# EAGLE design voice board kombi (EAGLE 6.5.0)
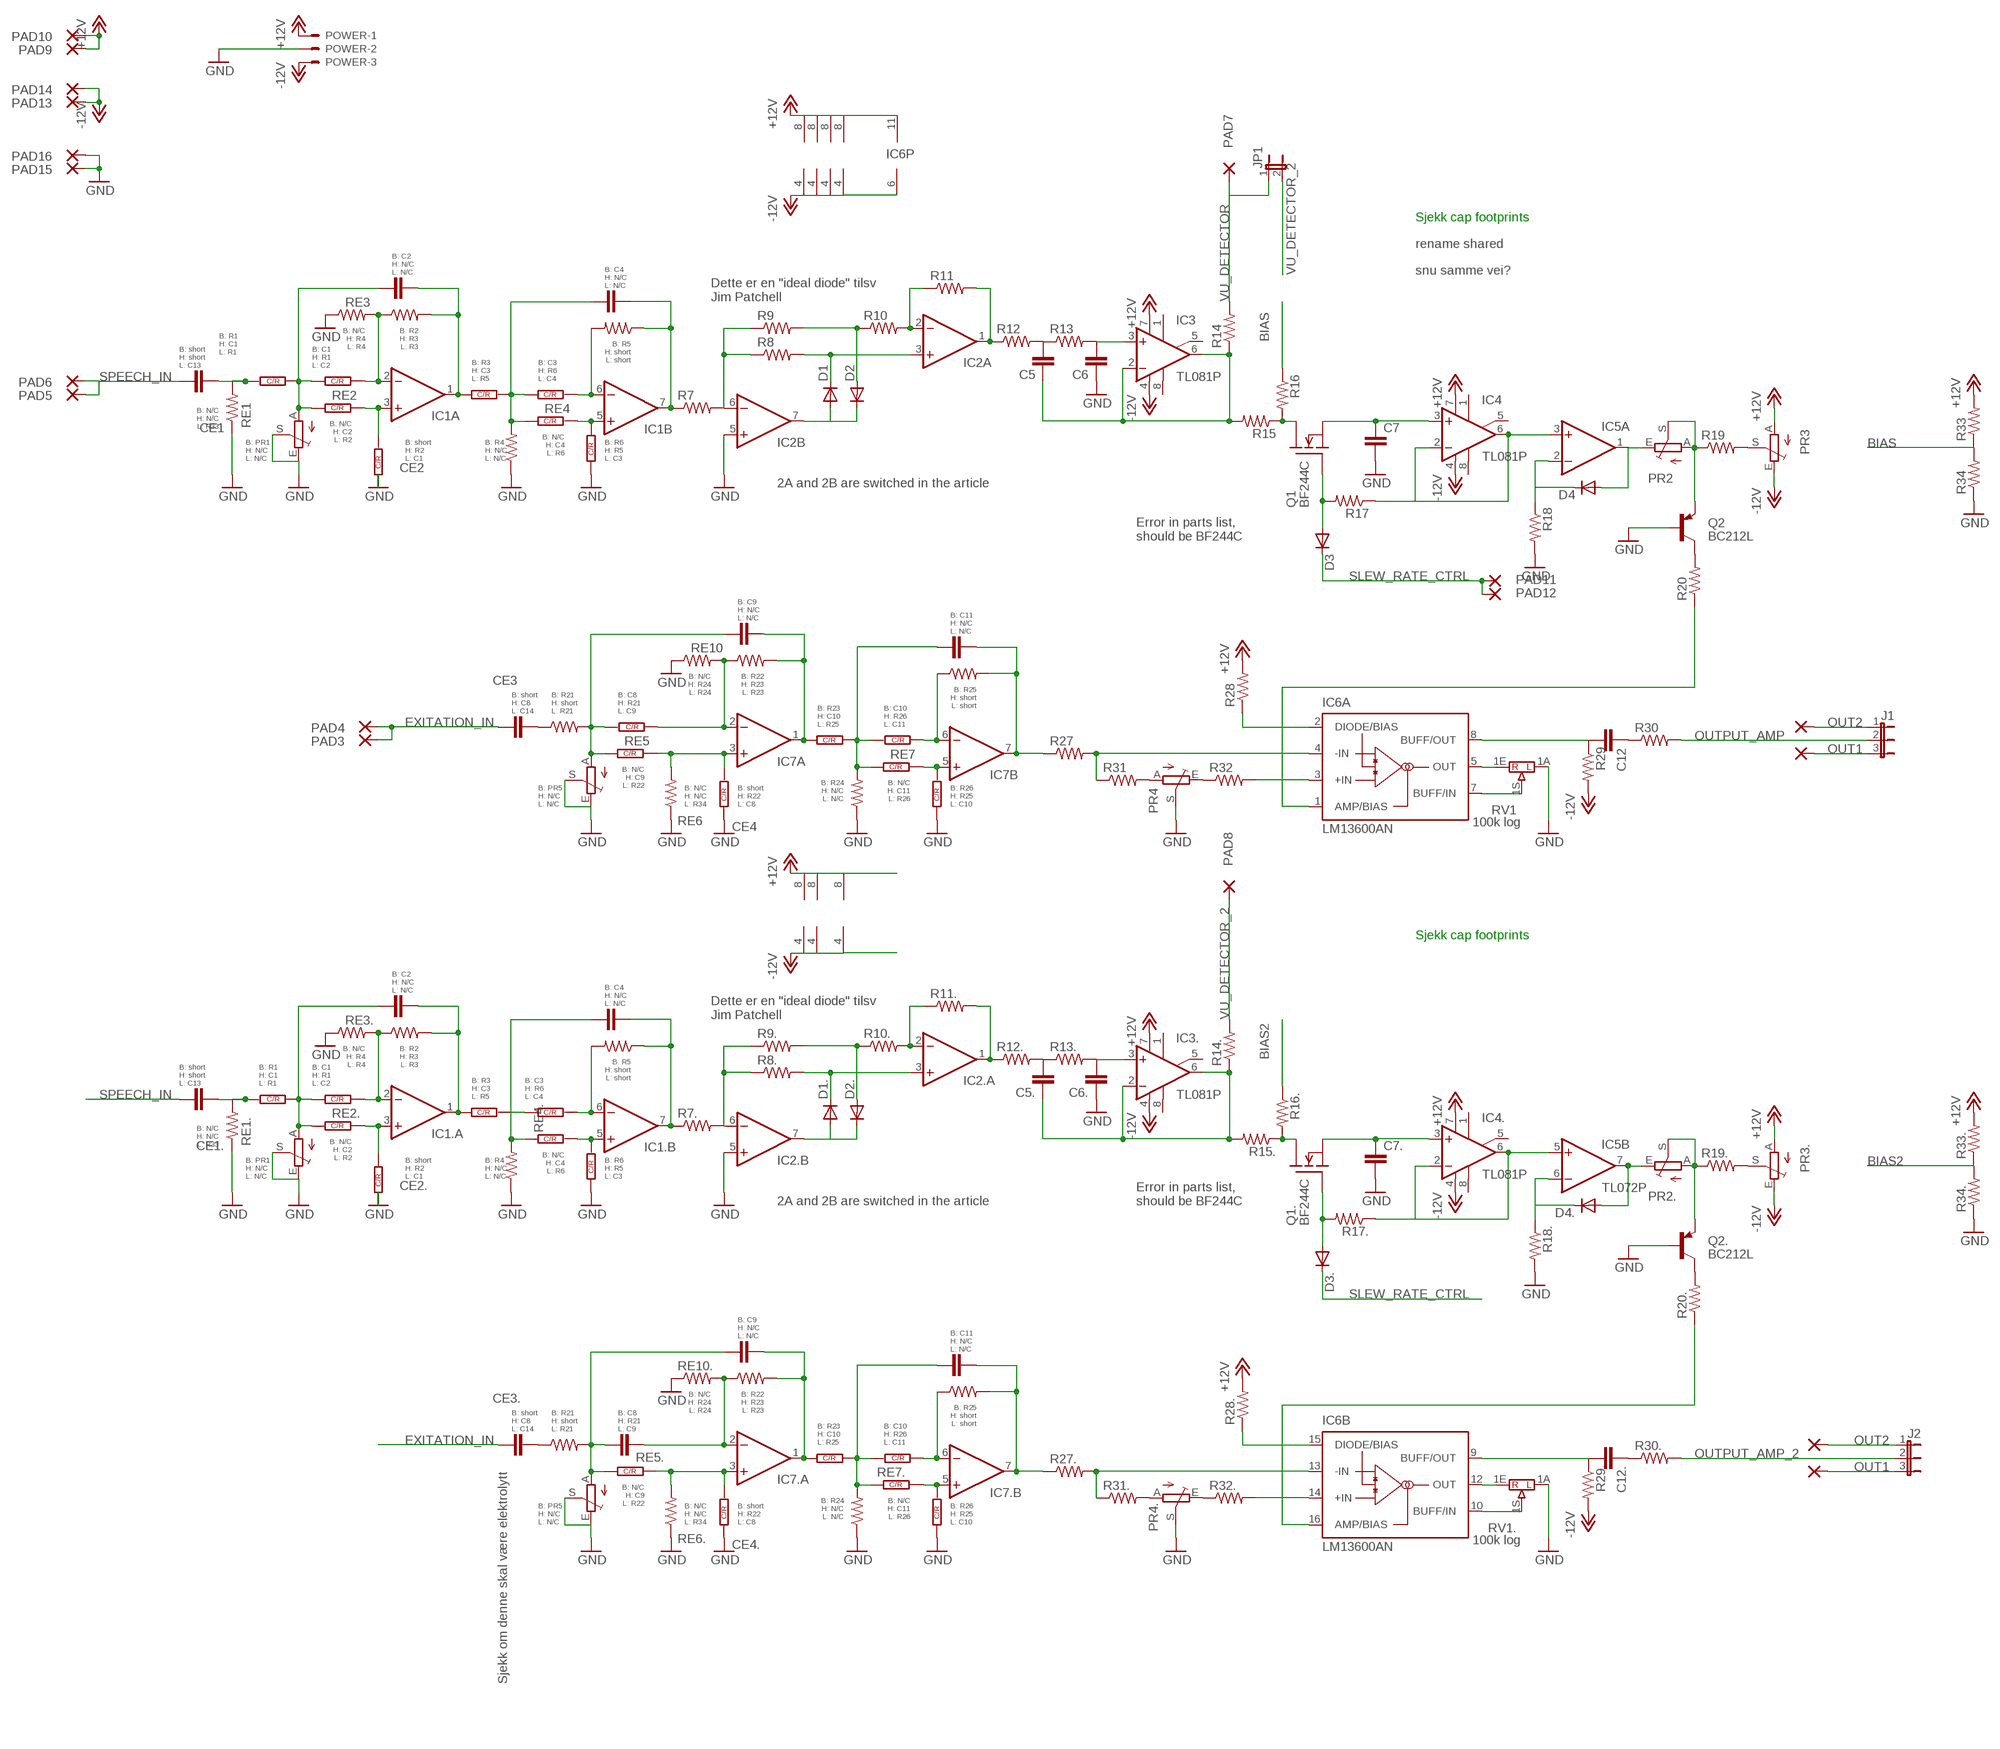
[diagram p0: schematic, sheet 1]

## Parts
C1  C-OR-R050_075-025X100  [P050_075-025X100J]
C1.  C-OR-R050_075-025X100  [P050_075-025X100J]
C2  C-EU050_075-025X100  [C050_075-025X100J]
C2.  C-EU050_075-025X100  [C050_075-025X100J]
C3  C-OR-R050_075-025X100  [P050_075-025X100J]
C3.  C-OR-R050_075-025X100  [P050_075-025X100J]
C4  C-EU050_075-025X100  [C050_075-025X100J]
C4.  C-EU050_075-025X100  [C050_075-025X100J]
C5  C-EU050_075-025X100  [C050_075-025X100J]
C5.  C-EU050_075-025X100  [C050_075-025X100J]
C6  C-EU050_075-025X100  [C050_075-025X100J]
C6.  C-EU050_075-025X100  [C050_075-025X100J]
C7  C-EU050_075-025X100  [C050_075-025X100J]
C7.  C-EU050_075-025X100  [C050_075-025X100J]
C8  C-OR-R050_075-025X100  [P050_075-025X100J]
C8.  C-EU050_075-025X100  [C050_075-025X100J]
C9  C-EU050_075-025X100  [C050_075-025X100J]
C9.  C-EU050_075-025X100  [C050_075-025X100J]
C10  C-OR-R050_075-025X100  [P050_075-025X100J]
C10.  C-OR-R050_075-025X100  [P050_075-025X100J]
C11  C-EU050_075-025X100  [C050_075-025X100J]
C11.  C-EU050_075-025X100  [C050_075-025X100J]
C12  C-EU050_075-025X100  [C050_075-025X100J]
C12.  C-EU050_075-025X100  [C050_075-025X100J]
CE1  C-EU050_075-025X100  [C050_075-025X100J]
CE1.  C-EU050_075-025X100  [C050_075-025X100J]
CE2  C-OR-R050_075-025X100  [P050_075-025X100J]
CE2.  C-OR-R050_075-025X100  [P050_075-025X100J]
CE3  C-EU050_075-025X100  [C050_075-025X100J]
CE3.  C-EU050_075-025X100  [C050_075-025X100J]
CE4  C-OR-R050_075-025X100  [P050_075-025X100J]
CE4.  C-OR-R050_075-025X100  [P050_075-025X100J]
D1  DIODE-D-5  [D-5]
D1.  DIODE-D-5  [D-5]
D2  DIODE-D-5  [D-5]
D2.  DIODE-D-5  [D-5]
D3  DIODE-D-5  [D-5]
D3.  DIODE-D-5  [D-5]
D4  DIODE-D-5  [D-5]
D4.  DIODE-D-5  [D-5]
IC1  TL072P  [DIL08]
IC1.  TL072P  [DIL08]
IC2  TL072P  [DIL08]
IC2.  TL072P  [DIL08]
IC3  TL081P  [DIL08]
IC3.  TL081P  [DIL08]
IC4  TL081P  [DIL08]
IC4.  TL081P  [DIL08]
IC5  TL072P  [DIL08]
IC6  LM13600AN  [DIL16]
IC7  TL072P  [DIL08]
IC7.  TL072P  [DIL08]
J1  JP2E  [JP2]
J2  JP2E  [JP2]
JP1  JP1E  [JP1]
PAD1  WIREPAD2,54/1,1  [2,54/1,1]
PAD2  WIREPAD2,54/1,1  [2,54/1,1]
PAD3  WIREPAD2,54/1,1  [2,54/1,1]
PAD4  WIREPAD2,54/1,1  [2,54/1,1]
PAD5  WIREPAD2,54/1,1  [2,54/1,1]
PAD6  WIREPAD2,54/1,1  [2,54/1,1]
PAD7  WIREPAD2,54/1,1  [2,54/1,1]
PAD8  WIREPAD2,54/1,1  [2,54/1,1]
PAD9  WIREPAD2,54/1,1  [2,54/1,1]
PAD10  WIREPAD2,54/1,1  [2,54/1,1]
PAD11  WIREPAD2,54/1,1  [2,54/1,1]
PAD12  WIREPAD2,54/1,1  [2,54/1,1]
PAD13  WIREPAD2,54/1,1  [2,54/1,1]
PAD14  WIREPAD2,54/1,1  [2,54/1,1]
PAD15  WIREPAD2,54/1,1  [2,54/1,1]
PAD16  WIREPAD2,54/1,1  [2,54/1,1]
PAD17  WIREPAD2,54/1,1  [2,54/1,1]
PAD18  WIREPAD2,54/1,1  [2,54/1,1]
POWER  KK-156-3  [KK-156-3]
PR1  TRIM_EU-CA9V  [CA9V]
PR1.  TRIM_EU-CA9V  [CA9V]
PR2  TRIM_EU-CA9V  [CA9V]
PR2.  TRIM_EU-CA9V  [CA9V]
PR3  TRIM_EU-CA9V  [CA9V]
PR3.  TRIM_EU-CA9V  [CA9V]
PR4  TRIM_EU-CA9V  [CA9V]
PR4.  TRIM_EU-CA9V  [CA9V]
PR5  TRIM_EU-CA9V  [CA9V]
PR5.  TRIM_EU-CA9V  [CA9V]
Q1  BF244C  TN0602N3  [TO-92]
Q1.  BF244C  TN0602N3  [TO-92]
Q2  BC212L  -PNP-TO92-ECB  [TO92-ECB]
Q2.  BC212L  -PNP-TO92-ECB  [TO92-ECB]
R1  C-OR-R050_075-025X100  [P050_075-025X100J]
R1.  C-OR-R050_075-025X100  [P050_075-025X100J]
R2  R-US_0207/7  [0207/7]
R2.  R-US_0207/7  [0207/7]
R3  C-OR-R050_075-025X100  [P050_075-025X100J]
R3.  C-OR-R050_075-025X100  [P050_075-025X100J]
R4  R-US_0207/7  [0207/7]
R4.  R-US_0207/7  [0207/7]
R5  R-US_0207/7  [0207/7]
R5.  R-US_0207/7  [0207/7]
R6  C-OR-R050_075-025X100  [P050_075-025X100J]
R6.  C-OR-R050_075-025X100  [P050_075-025X100J]
R7  R-US_0207/7  [0207/7]
R7.  R-US_0207/7  [0207/7]
R8  R-US_0207/7  [0207/7]
R8.  R-US_0207/7  [0207/7]
R9  R-US_0207/7  [0207/7]
R9.  R-US_0207/7  [0207/7]
R10  R-US_0207/7  [0207/7]
R10.  R-US_0207/7  [0207/7]
R11  R-US_0207/7  [0207/7]
R11.  R-US_0207/7  [0207/7]
R12  R-US_0207/7  [0207/7]
R12.  R-US_0207/7  [0207/7]
R13  R-US_0207/7  [0207/7]
R13.  R-US_0207/7  [0207/7]
R14  R-US_0207/7  [0207/7]
R14.  R-US_0207/7  [0207/7]
R15  R-US_0207/7  [0207/7]
R15.  R-US_0207/7  [0207/7]
R16  R-US_0207/7  [0207/7]
R16.  R-US_0207/7  [0207/7]
R17  R-US_0207/7  [0207/7]
R17.  R-US_0207/7  [0207/7]
R18  R-US_0207/7  [0207/7]
R18.  R-US_0207/7  [0207/7]
R19  R-US_0207/7  [0207/7]
R19.  R-US_0207/7  [0207/7]
R20  R-US_0207/7  [0207/7]
R20.  R-US_0207/7  [0207/7]
R21  R-US_0207/7  [0207/7]
R21.  R-US_0207/7  [0207/7]
R22  R-US_0207/7  [0207/7]
R22.  R-US_0207/7  [0207/7]
R23  C-OR-R050_075-025X100  [P050_075-025X100J]
R23.  C-OR-R050_075-025X100  [P050_075-025X100J]
R24  R-US_0207/7  [0207/7]
R24.  R-US_0207/7  [0207/7]
R25  R-US_0207/7  [0207/7]
R25.  R-US_0207/7  [0207/7]
R26  C-OR-R050_075-025X100  [P050_075-025X100J]
R26.  C-OR-R050_075-025X100  [P050_075-025X100J]
R27  R-US_0207/7  [0207/7]
R27.  R-US_0207/7  [0207/7]
R28  R-US_0207/7  [0207/7]
R28.  R-US_0207/7  [0207/7]
R29  R-US_0207/7  [0207/7]
R29.  R-US_0207/7  [0207/7]
R30  R-US_0207/7  [0207/7]
R30.  R-US_0207/7  [0207/7]
R31  R-US_0207/7  [0207/7]
R31.  R-US_0207/7  [0207/7]
R32  R-US_0207/7  [0207/7]
R32.  R-US_0207/7  [0207/7]
R33  R-US_0207/7  [0207/7]
R33.  R-US_0207/7  [0207/7]
R34  R-US_0207/7  [0207/7]
R34.  R-US_0207/7  [0207/7]
RE1  R-US_0207/7  [0207/7]
RE1.  R-US_0207/7  [0207/7]
RE2  C-OR-R050_075-025X100  [P050_075-025X100J]
RE2.  C-OR-R050_075-025X100  [P050_075-025X100J]
RE3  R-US_0207/7  [0207/7]
RE3.  R-US_0207/7  [0207/7]
RE4  C-OR-R050_075-025X100  [P050_075-025X100J]
RE4.  C-OR-R050_075-025X100  [P050_075-025X100J]
RE5  C-OR-R050_075-025X100  [P050_075-025X100J]
RE5.  C-OR-R050_075-025X100  [P050_075-025X100J]
RE6  R-US_0207/7  [0207/7]
RE6.  R-US_0207/7  [0207/7]
RE7  C-OR-R050_075-025X100  [P050_075-025X100J]
RE7.  C-OR-R050_075-025X100  [P050_075-025X100J]
RE10  R-US_0207/7  [0207/7]
RE10.  R-US_0207/7  [0207/7]
RV1  100k log  POT16_W_BRACKET""  [POT16_W_BRACKET]
RV1.  100k log  POT16_W_BRACKET""  [POT16_W_BRACKET]

## Nets
+12V: IC1.8(P:V+) IC1..8(P:V+) IC2.8(P:V+) IC2..8(P:V+) IC3.7(V+) IC3..7(V+) IC4.7(V+) IC4..7(V+) IC5.8(P:V+) IC6.11(P:V+) IC7.8(P:V+) IC7..8(P:V+) PAD9.1(P) PAD10.1(P) POWER.1 PR3..A PR3.A R28.2 R28..2 R33.2 R33..2
-12V: IC1.4(P:V-) IC1..4(P:V-) IC2.4(P:V-) IC2..4(P:V-) IC3.4(V-) IC3..4(V-) IC4.4(V-) IC4..4(V-) IC5.4(P:V-) IC6.6(P:V-) IC7.4(P:V-) IC7..4(P:V-) PAD13.1(P) PAD14.1(P) POWER.3 PR3..E PR3.E R29.2 R29..2
BIAS: R16.1 R33.1 R34.2
BIAS2: R16..1 R33..1 R34..2
EXITATION_IN: CE3.1 CE3..1 PAD3.1(P) PAD4.1(P)
GND: C6.1 C6..1 C7.2 C7.3 C7..2 C7..3 CE2.1 CE2..1 CE4.1 CE4..1 IC2.5(B:+IN) IC2..5(B:+IN) PAD15.1(P) PAD16.1(P) POWER.2 PR1..E PR1..S PR1.E PR1.S PR4..S PR4.S PR5..E PR5..S PR5.E PR5.S Q2..B Q2.B R4.1 R4..1 R6.1 R6..1 R18.2 R18..2 R24.1 R24..1 R26.1 R26..1 R34.1 R34..1 RE1.1 RE1..1 RE3.1 RE3..1 RE6.1 RE6..1 RE10.1 RE10..1 RV1.1A RV1..1A
N$1: C1.2 C1.3 IC1.2(A:-IN) R2.1 RE3.2
N$2: C1.1 C2.1 PR1.A R1.1 RE2.1
N$3: C2.2 C2.3 IC1.1(A:OUT) R2.2 R3.1
N$4: IC2.6(B:-IN) R7.2 R8.1 R9.1
N$5: C3.1 C4.1 R3.2 R3.3 R4.2 RE4.1
N$6: C3.2 C3.3 IC1.6(B:-IN) R5.2
N$7: IC1.5(B:+IN) R6.2 R6.3 RE4.2 RE4.3
N$8: C4.2 C4.3 IC1.7(B:OUT) R5.1 R7.1
N$9: D1.C IC2.3(A:+IN) R8.2
N$10: D1.A D2.C IC2.7(B:OUT)
N$11: D2.A R9.2 R10.1
N$12: IC2.2(A:-IN) R10.2 R11.1
N$13: IC2.1(A:OUT) R11.2 R12.1
N$14: C5.2 C5.3 R12.2 R13.1
N$15: C5.1 IC3.2(-IN) IC3.6(OUT) R14.1 R15.2
N$16: C6.2 C6.3 IC3.3(+IN) R13.2
N$17: Q1.3(D) R15.1 R16.2
N$18: C7.1 IC4.3(+IN) Q1.1(S)
N$19: D3.A Q1.2(G) R17.2
N$20: IC4.2(-IN) IC4.6(OUT) IC5.3(A:+IN) R17.1
N$21: D4.C IC5.2(A:-IN) R18.1
N$22: D4.A IC5.1(A:OUT) PR2.E
N$23: PR2.A PR2.S Q2.E R19.1
N$24: PR3.S R19.2
N$25: Q2.C R20.2
N$26: PR4.A R31.2
N$27: C8.2 C8.3 C9.2 C9.3 PR5.A R21.2 RE5.1
N$28: C10.2 C10.3 C11.2 C11.3 R23.2 R23.3 R24.2 RE7.1
N$29: C8.1 IC7.2(A:-IN) R22.1 RE10.2
N$30: C9.1 IC7.1(A:OUT) R22.2 R23.1
N$31: C10.1 IC7.6(B:-IN) R25.1
N$32: IC7.5(B:+IN) R26.2 R26.3 RE7.2 RE7.3
N$33: C12.2 C12.3 IC6.8(A:BUFF/OUT) R29.1
N$34: C12.1 R30.1
N$35: C11.1 IC7.7(B:OUT) R25.2 R27.1
N$36: PR4.E R32.1
N$37: IC6.3(A:+IN) R32.2
N$38: IC6.2(A:DIODE/BIAS) R28.1
N$39: IC6.4(A:-IN) R27.2 R31.1
N$40: IC6.1(A:AMP/BIAS) R20.1
N$41: IC6.5(A:OUT) RV1.1E
N$42: IC6.7(A:BUFF/IN) RV1.1S
N$43: CE1.1 R1.2 R1.3 RE1.2
N$44: CE2.2 CE2.3 IC1.3(A:+IN) RE2.2 RE2.3
N$45: CE3.2 CE3.3 R21.1
N$46: CE4.2 CE4.3 IC7.3(A:+IN) RE5.2 RE5.3 RE6.2
N$47: C1..2 C1..3 IC1..2(A:-IN) R2..1 RE3..2
N$48: C1..1 C2..1 PR1..A R1..1 RE2..1
N$49: C2..2 C2..3 IC1..1(A:OUT) R2..2 R3..1
N$50: C3..1 C4..1 R3..2 R3..3 R4..2 RE4..1
N$51: C3..2 C3..3 IC1..6(B:-IN) R5..2
N$52: IC1..5(B:+IN) R6..2 R6..3 RE4..2 RE4..3
N$53: C4..2 C4..3 IC1..7(B:OUT) R5..1 R7..1
N$54: IC2..6(B:-IN) R7..2 R8..1 R9..1
N$55: D1..C IC2..3(A:+IN) R8..2
N$56: D1..A D2..C IC2..7(B:OUT)
N$57: D2..A R9..2 R10..1
N$58: IC2..2(A:-IN) R10..2 R11..1
N$59: IC2..1(A:OUT) R11..2 R12..1
N$60: C5..2 C5..3 R12..2 R13..1
N$61: C5..1 IC3..2(-IN) IC3..6(OUT) R14..1 R15..2
N$62: C6..2 C6..3 IC3..3(+IN) R13..2
N$63: Q1..3(D) R15..1 R16..2
N$64: C7..1 IC4..3(+IN) Q1..1(S)
N$65: D3..A Q1..2(G) R17..2
N$66: IC4..2(-IN) IC4..6(OUT) IC5.5(B:+IN) R17..1
N$67: D4..C IC5.6(B:-IN) R18..1
N$68: D4..A IC5.7(B:OUT) PR2..E
N$69: PR2..A PR2..S Q2..E R19..1
N$70: PR3..S R19..2
N$71: Q2..C R20..2
N$72: PR4..A R31..2
N$73: C8..2 C8..3 C9..2 C9..3 PR5..A R21..2 RE5..1
N$74: C10..2 C10..3 C11..2 C11..3 R23..2 R23..3 R24..2 RE7..1
N$75: C8..1 IC7..2(A:-IN) R22..1 RE10..2
N$76: C9..1 IC7..1(A:OUT) R22..2 R23..1
N$77: C11..1 IC7..7(B:OUT) R25..2 R27..1
N$78: PR4..E R32..1
N$79: IC6.14(B:+IN) R32..2
N$80: IC6.15(B:DIODE/BIAS) R28..1
N$81: IC6.13(B:-IN) R27..2 R31..1
N$82: IC6.16(B:AMP/BIAS) R20..1
N$83: IC6.10(B:BUFF/IN) RV1..1S
N$84: C12..2 C12..3 IC6.9(B:BUFF/OUT) R29..1
N$85: C12..1 R30..1
N$86: C10..1 IC7..6(B:-IN) R25..1
N$87: IC7..5(B:+IN) R26..2 R26..3 RE7..2 RE7..3
N$88: CE1..1 R1..2 R1..3 RE1..2
N$89: CE2..2 CE2..3 IC1..3(A:+IN) RE2..2 RE2..3
N$90: CE3..2 CE3..3 R21..1
N$91: CE4..2 CE4..3 IC7..3(A:+IN) RE5..2 RE5..3 RE6..2
N$92: IC6.12(B:OUT) RV1..1E
OUT1: J1.3 J2.3 PAD1.1(P) PAD2.1(P)
OUT2: J1.1 J2.1 PAD17.1(P) PAD18.1(P)
OUTPUT_AMP: J1.2 R30.2
OUTPUT_AMP_2: J2.2 R30..2
SLEW_RATE_CTRL: D3..C D3.C PAD11.1(P) PAD12.1(P)
SPEECH_IN: CE1.2 CE1.3 CE1..2 CE1..3 PAD5.1(P) PAD6.1(P)
VU_DETECTOR: JP1.1 PAD7.1(P) R14.2
VU_DETECTOR_2: JP1.2 PAD8.1(P) R14..2
Unconnected: IC3.1(ON1) IC3.5(ON2) IC3.8(OPT) IC3..1(ON1) IC3..5(ON2) IC3..8(OPT) IC4.1(ON1) IC4.5(ON2) IC4.8(OPT) IC4..1(ON1) IC4..5(ON2) IC4..8(OPT) RV1..M1 RV1..M2 RV1..M3 RV1..M4 RV1.M1 RV1.M2 RV1.M3 RV1.M4

## Notes on the sheet
- Sjekk cap footprints
- rename shared
- B: C2
  H: N/C
  L: N/C
- snu samme vei?
- B: C4
  H: N/C
  L: N/C
- Dette er en "ideal diode" tilsv
  Jim Patchell
- B: N/C
  H: R4
  L: R4
- B: R2
  H: R3
  L: R3
- B: R5
  H: short
  L: short
- B: R1
  H: C1
  L: R1
- B: short
  H: short
  L: C13
- B: C1
  H: R1
  L: C2
- B: R3
  H: C3
  L: R5
- B: C3
  H: R6
  L: C4
- B: N/C
  H: N/C
  L: R33
- B: N/C
  H: C2
  L: R2
- B: N/C
  H: C4
  L: R6
- B: PR1
  H: N/C
  L: N/C
- B: short
  H: R2
  L: C1
- B: R4
  H: N/C
  L: N/C
- B: R6
  H: R5
  L: C3
- 2A and 2B are switched in the article
- Error in parts list, 
  should be BF244C
- B: C9
  H: N/C
  L: N/C
- B: C11
  H: N/C
  L: N/C
- B: N/C
  H: R24
  L: R24
- B: R22
  H: R23
  L: R23
- B: R25
  H: short
  L: short
- B: short
  H: C8
  L: C14
- B: R21
  H: short
  L: R21
- B: C8
  H: R21
  L: C9
- B: R23
  H: C10
  L: R25
- B: C10
  H: R26
  L: C11
- B: N/C
  H: C9
  L: R22
- B: R24
  H: N/C
  L: N/C
- B: N/C
  H: C11
  L: R26
- B: PR5
  H: N/C
  L: N/C
- B: N/C
  H: N/C
  L: R34
- B: short
  H: R22
  L: C8
- B: R26
  H: R25
  L: C10
- Sjekk cap footprints
- B: C2
  H: N/C
  L: N/C
- B: C4
  H: N/C
  L: N/C
- Dette er en "ideal diode" tilsv
  Jim Patchell
- B: N/C
  H: R4
  L: R4
- B: R2
  H: R3
  L: R3
- B: R5
  H: short
  L: short
- B: short
  H: short
  L: C13
- B: R1
  H: C1
  L: R1
- B: C1
  H: R1
  L: C2
- B: R3
  H: C3
  L: R5
- B: C3
  H: R6
  L: C4
- B: N/C
  H: N/C
  L: R33
- B: N/C
  H: C2
  L: R2
- B: N/C
  H: C4
  L: R6
- B: PR1
  H: N/C
  L: N/C
- B: short
  H: R2
  L: C1
- B: R4
  H: N/C
  L: N/C
- B: R6
  H: R5
  L: C3
- 2A and 2B are switched in the article
- Error in parts list, 
  should be BF244C
- B: C9
  H: N/C
  L: N/C
- B: C11
  H: N/C
  L: N/C
- B: N/C
  H: R24
  L: R24
- B: R22
  H: R23
  L: R23
- B: R25
  H: short
  L: short
- B: short
  H: C8
  L: C14
- B: R21
  H: short
  L: R21
- B: C8
  H: R21
  L: C9
- B: R23
  H: C10
  L: R25
- B: C10
  H: R26
  L: C11
- Sjekk om denne skal være elektrolytt
- B: N/C
  H: C9
  L: R22
- B: R24
  H: N/C
  L: N/C
- B: N/C
  H: C11
  L: R26
- B: PR5
  H: N/C
  L: N/C
- B: N/C
  H: N/C
  L: R34
- B: short
  H: R22
  L: C8
- B: R26
  H: R25
  L: C10

## Library data of the parts
C1 C1. C3 C3. C8 C10 C10. CE2 CE2. CE4 CE4. R1 R1. R3 R3. R6 R6. R23 R23. R26 R26. RE2 RE2. RE4 RE4. RE5 RE5. RE7 RE7. = joakim:C-OR-R: Combined part for resistors and capacitors
C2 C2. C4 C4. C5 C5. C6 C6. C7 C7. C8. C9 C9. C11 C11. C12 C12. CE1 CE1. CE3 CE3. = joakim:C-EU: CAPACITOR, European symbol
D1 D1. D2 D2. D3 D3. D4 D4. = diode:DIODE-: DIODE
IC1 IC1. IC2 IC2. IC5 IC7 IC7. = linear:TL072: OP AMP
IC3 IC3. IC4 IC4. = linear:TL081: OP AMP
IC6 = national-semiconductor:LM13600: Dual Operational Transconductance Amplifiers with Linearizing Diodes and Buffers Source: lm13600.PDF
J1 J2 = jumper:JP2E: JUMPER
JP1 = jumper:JP1E: JUMPER
PAD1-PAD18 = wirepad:WIREPAD: Wire PAD connect wire on PCB
POWER = con-molex:KK-156-3: KK 156 HEADER Source: http://www.molex.com/pdm_docs/sd/026604100_sd.pdf; OC_FARNELL: unknown; OC_NEWARK: unknown
PR1 PR1. PR2 PR2. PR3 PR3. PR4 PR4. PR5 PR5. = pot:TRIM_EU-: POTENTIOMETER
Q1 Q1. = transistor-fet:TN0602N3: N-Channel Enhancement MOSFET 20V; 4A; 0,75Ohm
Q2 Q2. = transistor-neu-to92:*-PNP-: PNP Transistror
R2 R2. R4 R4. R5 R5. R7 R7. R8 R8. R9 R9. R10 R10. R11 R11. R12 R12. R13 R13. R14 R14. R15 R15. R16 R16. R17 R17. R18 R18. R19 R19. R20 R20. R21 R21. R22 R22. R24 R24. R25 R25. R27 R27. R28 R28. R29 R29. R30 R30. R31 R31. R32 R32. R33 R33. R34 R34. RE1 RE1. RE3 RE3. RE6 RE6. RE10 RE10. = resistor:R-US_: RESISTOR, American symbol
RV1 RV1. = joakim:POT16_W_BRACKET: POTENTIOMETER potentiometer, 16 mm w 5mm pitch and OMEG bracket, 17,8 x 7,5 mm

## Board
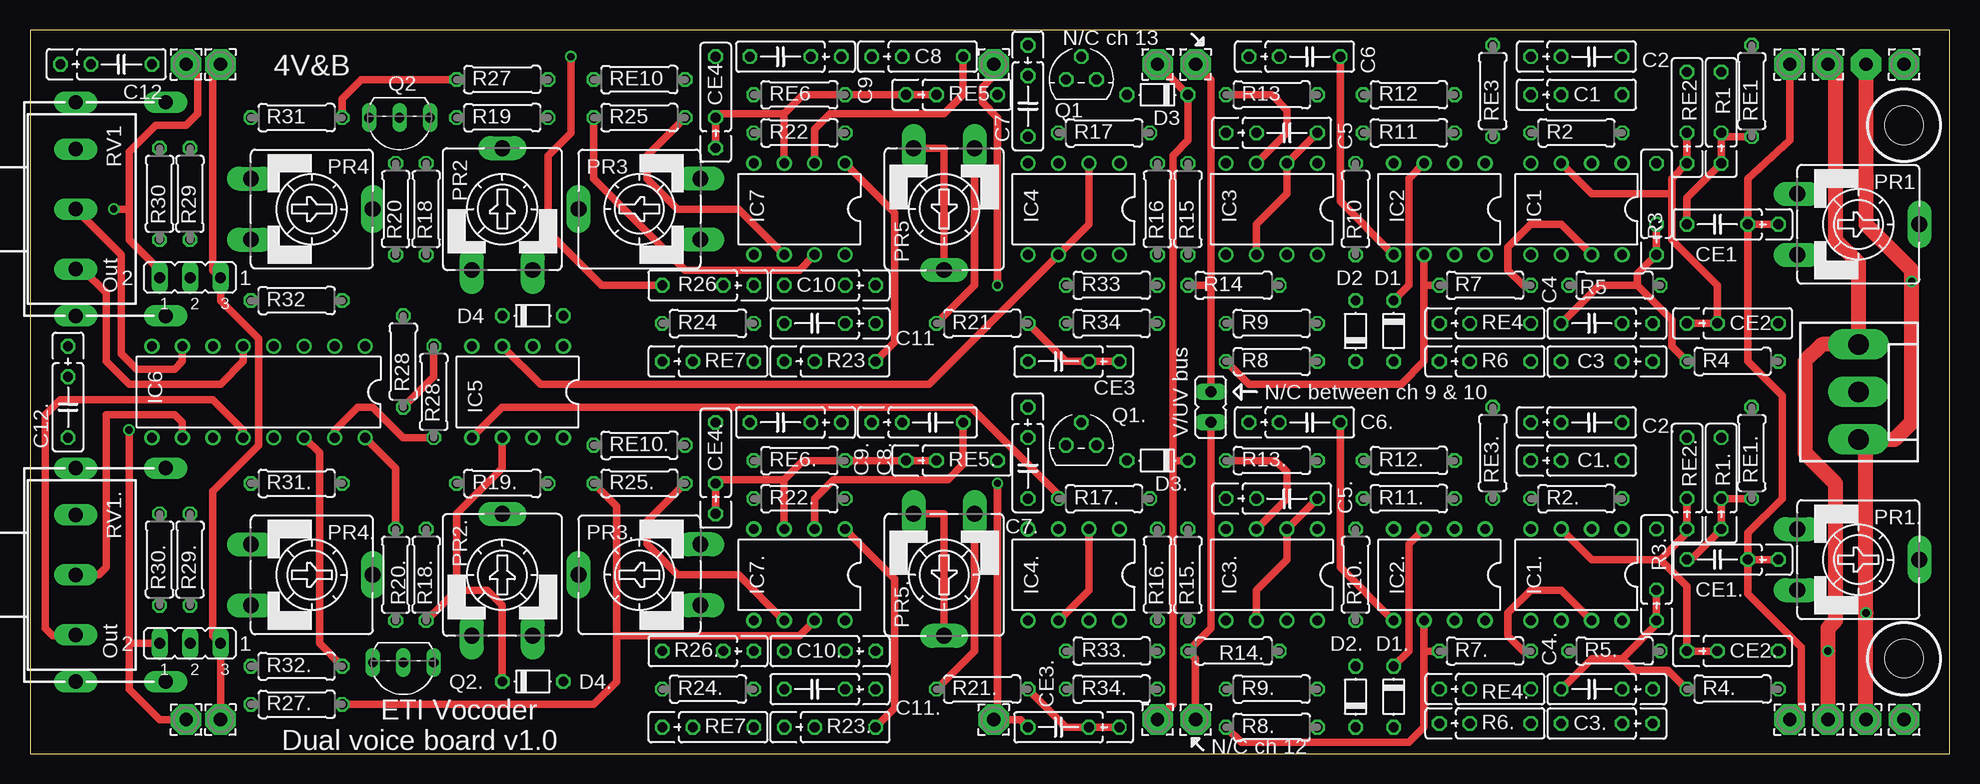
[diagram p1: board, top side]
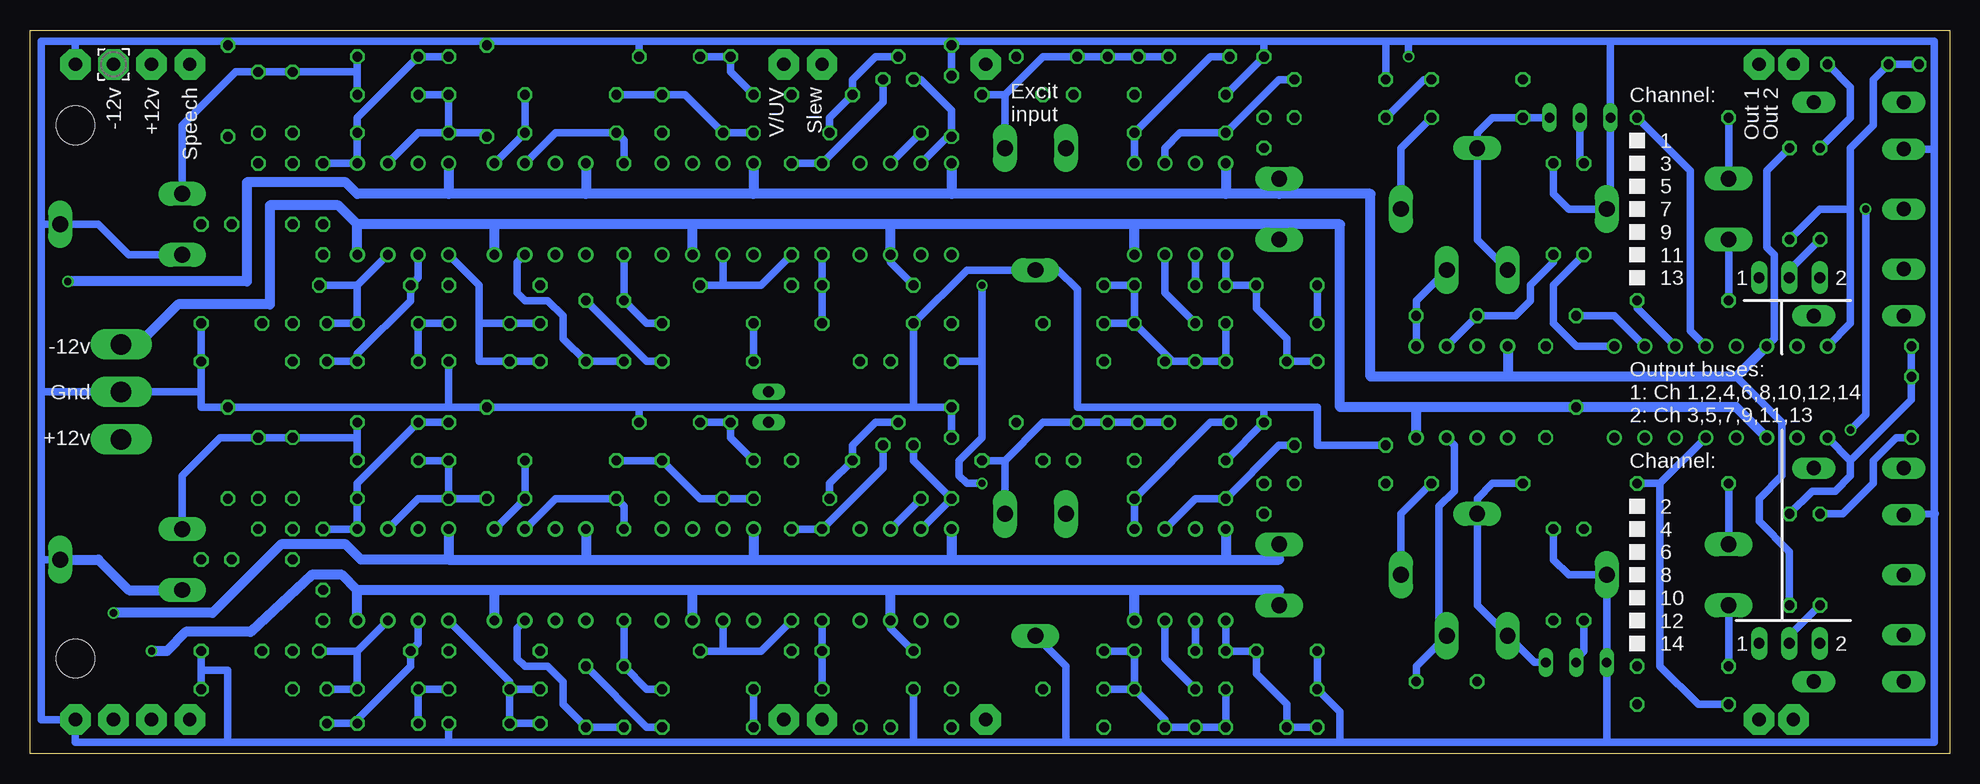
[diagram p2: board, bottom side, seen from below]

Size 160 x 60.33 mm. Coordinates in mm from the lower left corner, seen from the top.
Outline: 0,0 160,0 160,60.33 0,60.33 0,0
Copper layers (1*16): Top 0.0356mm / dielectric 1.5011mm / Bottom 0.0356mm
Design rules "oshpark-2layer": minimum track width 6mil, minimum drill 13mil, track to track 6mil, track to pad 6mil, pad to pad 6mil, via to via 6mil, smd to smd 6mil, copper to edge 15mil, drill to drill 6mil, minimum pad ring 7mil, minimum via ring 7mil, stop-mask expansion 2.5mil, vias tented up to drill 0mil, thermal gap 10mil
Holes 3.2 mm at 156.21,52.39 156.21,7.94

### Footprints (pad centres in the part's own frame; a part is rotated, then mirrored left to right if it is on the bottom)
P050_075-025X100J = drill 0.813 octagon: 1 -3.81,0; 2 1.27,0; 3 3.81,0
C050_075-025X100J = drill 0.813 octagon: 1 -2.54,0; 2 2.54,0; 3 5.08,0
D-5 = drill 0.813 octagon: A 2.54,0; C -2.54,0
DIL08 = drill 0.813 pad 1.27: 1 -3.81,-3.81; 2 -1.27,-3.81; 3 1.27,-3.81; 4 3.81,-3.81; 5 3.81,3.81; 6 1.27,3.81; 7 -1.27,3.81; 8 -3.81,3.81
DIL16 = drill 0.813 pad 1.27: 1 -8.89,-3.81; 2 -6.35,-3.81; 3 -3.81,-3.81; 4 -1.27,-3.81; 5 1.27,-3.81; 6 3.81,-3.81; 7 6.35,-3.81; 8 8.89,-3.81; 9 8.89,3.81; 10 6.35,3.81; 11 3.81,3.81; 12 1.27,3.81; 13 -1.27,3.81; 14 -3.81,3.81; 15 -6.35,3.81; 16 -8.89,3.81
JP2 = drill 0.914 long: 1 -2.54,0; 2 0,0; 3 2.54,0
JP1 = drill 0.914 long: 1 0,-1.27; 2 0,1.27
2,54/1,1 = drill 1.118 pad 2.54 octagon: 1 0,0
KK-156-3 = drill 1.7 pad 2.184 long: 1 -3.96,0; 2 0,0; 3 3.96,0
CA9V = drill 1.321 long: A -2.54,-5.08; E 2.54,-5.08; S 0,5.08
TO-92 = drill 0.813 octagon: 1 -1.27,0; 2 0,1.905; 3 1.27,0
TO92-ECB = drill 0.813 long: B 2.54,0; C 0,0; E -2.54,0
0207/7 = drill 0.813 octagon: 1 -3.81,0; 2 3.81,0
POT16_W_BRACKET = drill 1.2 long: 1A -5,0; 1E 5,0; 1S 0,0; M1 -8.9,0; M2 8.9,0; M3 8.9,7.5; M4 -8.9,7.5

### Placement (x,y rotation side)
C1  128.91,54.93 180 top
C1.  128.91,24.45 180 top
C2  130.18,58.1 180 top
C2.  130.18,27.62 180 top
C3  131.44,32.7 0 top
C3.  131.44,2.54 0 top
C4  130.18,35.88 0 top
C4.  130.18,5.4 0 top
C5  104.78,51.75 180 top
C5.  104.78,21.27 180 top
C6  106.68,58.1 180 top
C6.  106.68,27.62 180 top
C7  83.19,53.98 90 top
C7.  83.19,23.81 90 top
C8  73.98,58.1 180 top
C8.  75.25,27.62 180 top
C9  62.55,58.1 0 top
C9.  62.55,27.62 0 top
C10  66.67,39.05 0 top
C10.  66.67,8.57 0 top
C11  65.41,35.88 0 top
C11.  65.41,5.4 0 top
C12  7.62,57.47 180 top
C12.  3.17,28.89 90 top
CE1  140.65,44.13 0 top
CE1.  140.65,16.19 0 top
CE2  141.92,35.88 180 top
CE2.  141.92,8.57 180 top
CE3  85.72,32.7 0 top
CE3.  85.72,2.22 0 top
CE4  57.15,54.29 270 top
CE4.  57.15,23.81 270 top
D1  113.67,35.24 270 top
D1.  113.67,4.76 270 top
D2  110.49,35.24 90 top
D2.  110.49,4.76 90 top
D3  93.98,54.93 180 top
D3.  93.98,24.45 180 top
D4  41.91,36.51 0 top
D4.  41.91,6.03 0 top
IC1  128.91,45.4 180 top
IC1.  128.91,14.92 180 top
IC2  117.47,45.4 180 top
IC2.  117.47,14.92 180 top
IC3  103.5,45.4 180 top
IC3.  103.5,14.92 180 top
IC4  87,45.4 180 top
IC4.  87,14.92 180 top
IC5  40.64,30.16 180 top
IC6  19.05,30.16 180 top
IC7  64.14,45.4 180 top
IC7.  64.14,14.92 180 top
J1  13.34,39.69 0 top
J2  13.34,9.21 0 top
JP1  98.42,28.89 180 top
PAD1  15.88,57.47 0 top
PAD2  15.88,2.86 0 top
PAD3  80.33,57.47 0 top
PAD4  80.33,2.86 0 top
PAD5  146.69,57.47 0 top
PAD6  146.69,2.86 0 top
PAD7  97.16,57.47 0 top
PAD8  97.16,2.86 0 top
PAD9  149.86,2.86 0 top
PAD10  149.86,57.47 0 top
PAD11  93.98,2.86 0 top
PAD12  93.98,57.47 0 top
PAD13  153.03,57.47 0 bottom
PAD14  153.03,2.86 0 top
PAD15  156.21,57.47 0 top
PAD16  156.21,2.86 0 top
PAD17  13.02,57.47 0 top
PAD18  13.02,2.86 0 top
POWER  152.4,30.16 270 top
PR1  152.4,44.13 270 top
PR1.  152.4,16.19 270 top
PR2  39.37,45.4 0 top
PR2.  39.37,14.92 0 top
PR3  50.8,45.4 90 top
PR3.  50.8,14.92 90 top
PR4  23.5,45.4 270 top
PR4.  23.5,14.92 270 top
PR5  76.2,45.4 180 top
PR5.  76.2,14.92 180 top
Q1  87.63,56.2 0 top
Q1.  87.63,25.72 0 top
Q2  30.8,53.02 180 top
Q2.  31.11,7.62 180 top
R1  140.97,53.02 270 top
R1.  140.97,22.54 270 top
R2  128.91,51.75 0 top
R2.  128.91,21.27 0 top
R3  135.57,45.4 270 top
R3.  135.57,14.92 270 top
R4  141.92,32.7 180 top
R4.  141.92,5.4 180 top
R5  132.08,39.05 180 top
R5.  132.08,8.57 180 top
R6  121.28,32.7 180 top
R6.  121.28,2.54 180 top
R7  121.28,39.05 180 top
R7.  121.28,8.57 180 top
R8  103.5,32.7 0 top
R8.  103.5,2.22 0 top
R9  103.5,35.88 0 top
R9.  103.5,5.4 0 top
R10  110.49,45.4 90 top
R10.  110.49,14.92 90 top
R11  114.94,51.75 0 top
R11.  114.94,21.27 0 top
R12  114.94,54.93 180 top
R12.  114.94,24.45 180 top
R13  103.5,54.93 180 top
R13.  103.5,24.45 180 top
R14  100.33,39.05 180 top
R14.  100.33,8.57 180 top
R15  96.52,45.4 270 top
R15.  96.52,14.92 270 top
R16  93.98,45.4 90 top
R16.  93.98,14.92 90 top
R17  89.53,51.75 0 top
R17.  89.53,21.27 0 top
R18  33.02,45.4 90 top
R18.  33.02,14.92 90 top
R19  39.37,53.02 0 top
R19.  39.37,22.54 0 top
R20  30.48,45.4 90 top
R20.  30.48,14.92 270 top
R21  79.38,35.88 180 top
R21.  79.38,5.4 180 top
R22  64.14,51.75 0 top
R22.  64.14,21.27 0 top
R23  66.67,32.7 180 top
R23.  66.67,2.22 180 top
R24  56.52,35.88 0 top
R24.  56.52,5.4 0 top
R25  50.8,53.02 180 top
R25.  50.8,22.54 180 top
R26  56.52,39.05 0 top
R26.  56.52,8.57 0 top
R27  39.37,56.2 180 top
R27.  22.23,4.13 180 top
R28  31.11,32.7 270 top
R28.  33.66,30.16 90 top
R29  13.34,46.67 90 top
R29.  13.34,16.19 270 top
R30  10.79,46.67 270 top
R30.  10.79,16.19 270 top
R31  22.23,53.02 180 top
R31.  22.23,22.54 180 top
R32  22.23,37.78 0 top
R32.  22.23,7.3 0 top
R33  90.17,39.05 180 top
R33.  90.17,8.57 180 top
R34  90.17,35.88 0 top
R34.  90.17,5.4 0 top
RE1  143.51,55.24 270 top
RE1.  143.51,25.08 270 top
RE2  138.11,53.02 270 top
RE2.  138.11,22.54 270 top
RE3  121.92,55.24 270 top
RE3.  121.92,25.08 270 top
RE4  121.28,35.88 180 top
RE4.  121.28,5.4 180 top
RE5  76.83,54.93 180 top
RE5.  76.83,24.45 180 top
RE6  64.14,54.93 0 top
RE6.  64.14,24.45 0 top
RE7  56.52,32.7 180 top
RE7.  56.52,2.22 180 top
RE10  50.8,56.2 0 top
RE10.  50.8,25.72 0 top
RV1  3.81,45.4 270 top
RV1.  3.81,14.92 270 top

### Tracks (layer width: path | path; a pad name or v marks a point on that pad's centre or on a via)
+12V  (via drill 0.6)
  Top 0.61: R28.2 33.66,31.43 R28..2
  Top 0.813: v149.86,8.57 149.86,10.48
  Top 1.27: PAD10.1 149.86,57.15 150.5,56.52 150.5,42.86 152.4,40.96 POWER.1 149.38,34.12 147.96,32.7 147.96,25.08 150.5,22.54 150.5,11.11 149.86,10.48 PAD9.1
  Bottom 0.61: R33.2 88.27,40.96 IC4.7 | R33..2 88.27,10.48 IC4..7
  Bottom 0.813: IC1.8 132.72,44.13 | IC6.11 17.78,28.89 R28.2 44.45,28.89 | 44.45,28.89 50.8,28.89 50.8,44.13 55.88,44.13 | 55.88,44.13 67.94,44.13 | 67.94,44.13 88.27,44.13 | 88.27,44.13 104.78,44.13 | 104.78,44.13 121.28,44.13 | 121.28,44.13 132.72,44.13 | IC2.8 121.28,44.13 | IC3.7 104.78,44.13 | IC4.7 88.27,44.13 | IC7.8 67.94,44.13 | PR3.A 55.88,44.13 | IC5.8 44.45,28.89 | 132.72,44.13 134.3,45.72 140.02,45.72 140.02,37.47 147.64,37.47 150.98,34.12 POWER.1 | PR3..A 55.88,13.65 67.94,13.65 | 67.94,13.65 88.27,13.65 | 88.27,13.65 104.78,13.65 | 104.78,13.65 121.28,13.65 | 121.28,13.65 132.72,13.65 | 132.72,13.65 133.99,14.92 136.53,14.92 141.6,10.16 147,10.16 148.59,8.57 v149.86,8.57 | IC7..8 67.94,13.65 | IC4..7 88.27,13.65 | IC3..7 104.78,13.65 | IC2..8 121.28,13.65 | IC1..8 132.72,13.65
-12V  (via drill 0.6)
  Top 1.27: PAD13.1 153.03,44.13 156.84,40.32 v156.84,39.37 156.84,27.62 155.43,26.2 POWER.3 152.55,26.35 153.03,26.35 v153.03,11.75 PAD14.1
  Bottom 0.61: IC6.6 14.61,34.61 14.61,41.59 15.24,42.23 15.24,48.58 R29.2 | 17.78,31.43 13.97,27.62 13.97,23.18 15.88,21.27 15.88,19.37 13.34,16.83 R29..2
  Bottom 0.813: IC6.6 17.78,31.43 36.83,31.43 | 36.83,31.43 48.26,31.43 48.26,46.67 55.88,46.67 | 55.88,46.67 60.33,46.67 | 60.33,46.67 83.19,46.67 | 83.19,46.67 99.69,46.67 | 99.69,46.67 113.67,46.67 | 113.67,46.67 125.09,46.67 | 125.09,46.67 132.72,46.67 133.67,47.62 141.92,47.62 141.92,39.37 v156.84,39.37 | IC1.4 125.09,46.67 | IC2.4 113.67,46.67 | IC3.4 99.69,46.67 | IC4.4 83.19,46.67 | IC7.4 60.33,46.67 | PR3.E 55.88,46.67 | IC5.4 36.83,31.43 | 125.09,16.19 132.4,16.19 133.67,17.46 139.06,17.46 144.78,11.75 v153.03,11.75 | IC1..4 125.09,16.19 | 125.09,16.19 113.67,16.19 | 113.67,16.19 99.69,16.19 | 99.69,16.19 83.19,16.19 | 83.19,16.19 60.33,16.19 | 60.33,16.19 55.88,16.19 PR3..E | IC7..4 60.33,16.19 | IC4..4 83.19,16.19 | IC3..4 99.69,16.19 | IC2..4 113.67,16.19
BIAS
  Bottom 0.61: R16.1 R33.1 R34.2
BIAS2
  Bottom 0.61: R34..2 R33..1 R16..1
EXITATION_IN  (via drill 0.6)
  Top 0.61: v80.64,39.05 80.64,53.02 79.38,54.29 79.38,55.56 80.33,56.52 PAD3.1 | v80.64,22.54 80.64,2.86 PAD4.1 82.55,2.86 CE3..1
  Bottom 0.61: v80.64,39.05 80.64,32.7 | v80.64,22.54 81.92,22.54 82.55,23.18 82.55,24.45 80.64,26.35 80.64,32.7 | 80.64,32.7 CE3.1
GND  (via drill 0.6)
  Top 0.61: R26.1 47.62,39.05 43.18,43.5 43.18,49.85 45.09,51.75 v45.09,58.1 | PR5.E 76.2,50.48 PR5.S | 147.32,42.23 PR1.E | IC2.5 109.22,46.04 C6.1 | IC2..5 109.22,15.56 C6..1 | PR5..S 76.2,20 PR5..E
  Bottom 0.61: RV1.1A 1.35,50.4 1.27,50.48 | 1.27,50.48 1.27,59.37 28.26,59.37 | R18.2 33.02,46.67 31.75,45.4 PR4.S 28.26,45.72 Q2.B 28.26,59.37 | 28.26,59.37 45.09,59.37 | 45.09,59.37 46.99,59.37 | 46.99,59.37 57.15,59.37 | R26.1 R24.1 | v45.09,58.1 45.09,59.37 | RE10.1 46.99,59.37 | RE6.1 CE4.1 57.15,59.37 | 1.27,50.48 1.27,20 | 1.27,20 1.27,0.95 28.57,0.95 | 86.36,28.89 109.22,28.89 | 109.22,28.89 RE3..1 | RE3..1 125.09,28.89 | 125.09,28.89 125.41,28.89 RE1..1 145.73,28.89 145.73,30.16 | 145.73,30.16 POWER.2 159.07,30.16 | 159.07,30.16 159.07,44.13 | 159.07,44.13 159.07,59.37 156.21,59.37 | 156.21,59.37 143.51,59.37 | RE1.1 143.51,59.37 | 143.51,59.37 121.92,59.37 | 109.22,59.37 83.19,59.37 | 83.19,59.37 57.15,59.37 | C6.1 109.22,59.37 | R6.1 125.09,28.89 | 109.22,59.37 121.92,59.37 | 121.92,59.37 RE3.1 | 145.73,30.16 R4.1 CE2.1 | 159.07,44.13 PR1.S 154.31,44.13 151.76,41.59 PR1.E | PAD15.1 156.21,59.37 | 159.07,16.19 159.07,2.86 PAD16.1 156.21,0.95 143.51,0.95 | 159.07,16.19 159.07,30.16 | C6..1 109.22,28.89 | 57.15,28.89 72.71,28.89 72.71,38.73 74.3,40.32 PR5.S 81.92,40.32 R34.1 86.36,28.89 | RE6..1 CE4..1 57.15,28.89 | RE10..1 52.7,25.72 52.7,28.89 57.15,28.89 | 143.51,0.95 125.09,0.95 | 125.09,0.95 86.36,0.95 | 86.36,0.95 73.66,0.95 | 73.66,0.95 50.8,0.95 | 50.8,0.95 28.57,0.95 | 1.27,20 1.19,20 RV1..1A | 154.31,16.19 159.07,16.19 | R4..1 CE2..1 145.73,6.99 143.51,6.99 143.51,0.95 | R6..1 125.09,0.95 | PR5..S 73.66,7.3 73.66,0.95 | R34..1 86.36,0.95 | 86.36,28.89 C7..3 C7..2 | R18..2 33.02,16.19 31.75,14.92 PR4..S Q2..B 28.57,0.95 | 50.8,0.95 50.8,3.49 R24..1 R26..1 | 83.19,59.37 C7.3 C7.2 | RE3..1 125.09,28.89
  Bottom 0.813: PR1..S 154.31,16.19 151.76,13.65 PR1..E
N$1
  Bottom 0.61: C1.2 C1.3 R2.1 | IC1.2 127.64,51.75 R2.1 | R2.1 121.92,51.75 RE3.2
N$2
  Bottom 0.61: 132.72,56.83 C1.1 | C2.1 132.72,56.83 | 132.72,56.83 RE2.1 R1.1 142.88,56.83 147.32,52.39 PR1.A
N$3
  Bottom 0.61: R3.1 IC1.1 R2.2 132.72,53.02 C2.2 C2.3
N$4
  Top 0.61: R8.1 101.6,30.8 114.3,30.8 116.2,32.7 116.2,39.05 | 116.2,39.05 IC2.6 | R7.2 116.2,39.05
  Bottom 0.61: R8.1 R9.1
N$5
  Top 0.61: 133.99,39.05 133.99,40.01 R3.3 R3.2 | 133.99,39.05 130.81,39.05 C4.1 | R4.2 136.84,33.97 136.84,36.2 133.99,39.05
  Bottom 0.61: RE4.1 C4.1 C3.1
N$6
  Bottom 0.61: IC1.6 127.64,39.69 R5.2 128.27,37.78 132.72,33.34 C3.2 C3.3
N$7
  Bottom 0.61: 122.56,35.88 122.56,32.7 R6.2 R6.3 | 122.56,35.88 RE4.2 RE4.3 | 122.56,35.88 122.56,39.05 IC1.5
N$8
  Top 0.61: IC1.7 127.64,44.13 125.09,44.13 123.19,42.23 123.19,40.32 124.46,39.05 R7.1
  Bottom 0.61: 132.72,39.05 C4.2 C4.3 | 132.72,39.05 R5.1 | IC1.7 132.72,39.05
N$9
  Top 0.61: D1.C 114.94,39.05 114.94,47.94 IC2.3
  Bottom 0.61: R8.2 108.58,32.7 D1.C
N$10
  Bottom 0.61: IC2.7 119.38,40.96 119.38,38.42 118.75,37.78 116.84,37.78 115.57,36.51 115.57,34.61 D1.A D2.C
N$11
  Bottom 0.61: R10.1 D2.A 108.58,35.88 R9.2
N$12
  Bottom 0.61: R10.2 110.49,51.12 R11.1 116.2,51.75 IC2.2
N$13
  Bottom 0.61: IC2.1 R11.2 R12.1
N$14
  Bottom 0.61: R12.2 R13.1 105.41,54.93 C5.2 C5.3
N$15
  Top 0.61: IC3.6 102.23,44.13 104.78,46.67 IC3.2 C5.1
  Bottom 0.61: R15.2 99.06,39.05 102.23,39.05 | 102.23,39.05 R14.1 | IC3.6 102.23,39.05
N$16
  Top 0.61: IC3.3 104.78,51.75 104.78,53.66 103.5,54.93 R13.2
  Bottom 0.61: C6.2 C6.3 101.6,56.83 R13.2
N$17
  Bottom 0.61: Q1.3 88.9,54.29 R16.2 R15.1
N$18
  Bottom 0.61: IC4.3 83.5,51.44 C7.1 83.19,53.66 85.72,56.2 Q1.1
N$19
  Bottom 0.61: Q1.2 89.53,58.1 91.44,56.2 D3.A 93.34,53.02 R17.2
N$20
  Top 0.61: IC5.3 42.55,30.8 74.93,30.8 IC4.6 88.27,44.13 IC4.2
  Bottom 0.61: IC4.2 R17.1
N$21
  Bottom 0.61: R18.1 33.02,40.96 34.92,39.05 34.92,37.78 36.2,36.51 D4.C IC5.2
N$22
  Bottom 0.61: IC5.1 D4.A 44.45,37.78 PR2.E
N$23
  Bottom 0.61: PR2.A 39.37,42.86 PR2.S 39.37,51.75 38.1,53.02 R19.1 Q2.E
N$24
  Bottom 0.61: PR3.S 45.72,50.48 R19.2
N$25
  Bottom 0.61: R20.2 30.8,49.53 Q2.C
N$26
  Bottom 0.61: R31.2 PR4.A
N$27
  Top 0.61: R21.2 78.74,39.05 PR5.A
  Bottom 0.61: 78.74,54.93 75.56,58.1 C8.2 C8.3 C9.3 C9.2 | 78.74,54.93 RE5.1 | PR5.A 78.74,54.93
N$28
  Bottom 0.61: R23.3 R23.2 64.77,32.7 | R23.3 RE7.1 R24.2 | C11.2 65.25,33.18 64.77,32.7 | C11.2 C10.2 C10.3 | C11.2 C11.3 | R23.3 64.77,32.7
N$29
  Top 0.61: C8.1 77.79,54.93 76.2,53.34 66.67,53.34 65.41,52.07 IC7.2
  Bottom 0.61: IC7.2 65.41,50.48 64.14,51.75 R22.1 55.88,56.2 RE10.2
N$30
  Top 0.61: R23.1 72.07,34.29 72.07,45.09 IC7.1
  Bottom 0.61: IC7.1 R22.2 61.59,58.1 C9.1
N$31
  Top 0.61: R25.1 51.44,49.85 51.44,47.94 53.98,45.4 59.05,45.4 IC7.6
  Bottom 0.61: C10.1 IC7.6
N$32
  Bottom 0.61: IC7.5 R26.3 R26.2 57.78,37.15 55.24,34.61 RE7.2 RE7.3
N$33
  Bottom 0.61: R29.1 10.79,45.4 8.26,45.4 | IC6.8 8.26,35.88 8.26,45.4 | 8.26,45.4 8.26,50.48 6.35,52.39 6.35,56.2 C12.2 C12.3
N$34
  Bottom 0.61: C12.1 8.26,55.56 8.26,53.02 R30.1
N$35
  Top 0.61: R25.2 46.99,47.94 54.61,40.32 64.14,40.32 IC7.7
  Bottom 0.61: R27.1 43.81,56.2 R25.2 | C11.1 65.41,38.42 IC7.7
N$36
  Bottom 0.61: R32.1 PR4.E
N$37
  Bottom 0.61: IC6.3 26.04,37.15 R32.2
N$38
  Bottom 0.61: IC6.2 27.94,36.51 R28.1
N$39
  Top 0.61: R27.2 27.62,56.2 26.04,54.61 R31.1
  Bottom 0.61: R31.1 21.59,48.58 21.59,35.24 IC6.4
N$40
  Bottom 0.61: R20.1 33.02,39.05 33.02,35.88 31.11,33.97 IC6.1
N$41
  Top 0.61: RV1.1E 4.37,40.4 6.35,38.42 6.35,32.7 8.26,30.8 15.88,30.8 17.78,32.7 IC6.5
N$42
  Top 0.61: RV1.1S 7.62,41.59 7.62,33.34 8.89,32.07 12.06,32.07 12.7,32.7 IC6.7
N$43
  Top 0.61: 143.19,51.44 RE1.2 140.97,51.44 | CE1.1 138.11,46.35 R1.3 140.97,51.44 | R1.2 140.97,51.44
N$44
  Top 0.61: RE2.2 RE2.3 136.84,47.94 136.84,46.67 | 136.84,46.67 130.18,46.67 IC1.3 | 136.84,46.67 136.84,42.86 140.65,39.05 CE2.2 CE2.3
N$45
  Top 0.61: R21.1 86.36,32.7 CE3.2 CE3.3
N$46
  Top 0.61: 62.87,53.34 57.47,53.34 CE4.2 CE4.3 | 62.87,53.34 64.45,54.93 RE6.2 RE5.3 RE5.2 | IC7.3 62.87,53.34
N$47
  Bottom 0.61: RE3..2 R2..1 | R2..1 C1..3 C1..2 | R2..1 127.64,21.27 IC1..2
N$48
  Bottom 0.61: C1..1 132.72,26.35 | 132.72,26.35 C2..1 | 132.72,26.35 RE2..1 R1..1 144.15,26.35 147.32,23.18 PR1..A
N$49
  Bottom 0.61: R3..1 IC1..1 R2..2 132.72,22.54 C2..2 C2..3
N$50
  Top 0.61: 132.72,7.94 135.57,10.79 R3..3 R3..2 | 132.72,7.94 130.18,7.94 C4..1 | R4..2 136.53,6.99 133.67,6.99 132.72,7.94
  Bottom 0.61: C3..1 C4..1 RE4..1
N$51
  Bottom 0.61: IC1..6 127.64,9.21 R5..2 128.27,7.3 132.72,2.86 C3..2 C3..3
N$52
  Bottom 0.61: RE4..2 R6..2 R6..3 | RE4..2 120.02,6.03 IC1..5 | RE4..2 RE4..3
N$53
  Top 0.61: R7..1 124.46,8.57 123.19,9.84 123.19,11.75 125.09,13.65 127.64,13.65 IC1..7
  Bottom 0.61: 132.72,8.57 C4..2 C4..3 | 132.72,8.57 IC1..7 | R5..1 132.72,8.57
N$54
  Top 0.61: IC2..6 116.2,8.57 | 116.2,8.57 116.2,2.22 114.94,0.95 100.97,0.95 R8..1 | R7..2 116.2,8.57
  Bottom 0.61: R9..1 R8..1
N$55
  Top 0.61: D1..C 114.94,8.57 114.94,17.46 IC2..3
  Bottom 0.61: R8..2 108.58,2.22 D1..C
N$56
  Bottom 0.61: D2..C D1..A 115.57,4.13 115.57,6.03 116.84,7.3 118.75,7.3 119.38,7.94 119.38,10.48 IC2..7
N$57
  Bottom 0.61: R9..2 108.58,5.4 D2..A R10..1
N$58
  Bottom 0.61: R10..2 110.49,20.64 R11..1 116.2,21.27 IC2..2
N$59
  Bottom 0.61: IC2..1 R11..2 R12..1
N$60
  Bottom 0.61: R12..2 R13..1 104.14,21.27 C5..2 C5..3
N$61
  Top 0.61: C5..1 IC3..2 104.78,16.19 102.23,13.65 IC3..6
  Bottom 0.61: IC3..6 102.23,8.57 | 102.23,8.57 99.06,8.57 R15..2 | R14..1 102.23,8.57
N$62
  Top 0.61: IC3..3 104.78,21.27 104.78,23.5 103.82,24.45 R13..2
  Bottom 0.61: R13..2 101.6,26.35 C6..3 C6..2
N$63
  Bottom 0.61: Q1..3 88.9,23.81 R16..2 R15..1
N$64
  Bottom 0.61: Q1..1 86.36,24.45 C7..1 IC4..3
N$65
  Bottom 0.61: R17..2 93.34,22.54 D3..A 91.44,25.72 89.53,27.62 Q1..2
N$66
  Top 0.61: IC4..2 88.27,13.65 IC4..6 | IC5.5 39.37,28.89 78.42,28.89 85.72,21.59 R17..1
  Bottom 0.61: R17..1 IC4..2
N$67
  Top 0.61: IC5.6 39.37,23.81 35.56,20 35.56,13.65 | 35.56,13.65 R18..1 | D4..C 39.37,12.38 38.1,13.65 35.56,13.65
N$68
  Bottom 0.61: IC5.7 41.27,25.72 41.27,21.91 42.55,20.64 42.55,10.48 PR2..E 44.45,7.3 D4..A
N$69
  Bottom 0.61: R19..1 38.1,22.54 39.37,21.27 PR2..S 39.37,12.38 PR2..A 34.61,7.62 Q2..E
N$70
  Bottom 0.61: PR3..S 45.72,20 R19..2
N$71
  Bottom 0.61: R20..2 30.48,8.57 31.11,7.94 Q2..C
N$72
  Bottom 0.61: R31..2 PR4..A
N$73
  Top 0.61: PR5..A 78.74,8.57 R21..2
  Bottom 0.61: 78.74,24.45 75.56,27.62 C8..2 C8..3 C9..3 C9..2 | 78.74,24.45 PR5..A | RE5..1 78.74,24.45
N$74
  Bottom 0.61: C11..2 65.41,2.86 R23..2 | 64.77,2.22 R23..2 | R24..2 RE7..1 R23..3 R23..2 | C11..2 C10..2 C10..3 | C11..2 C11..3
N$75
  Top 0.61: IC7..2 65.41,21.27 66.99,22.86 76.52,22.86 77.79,24.13 C8..1
  Bottom 0.61: RE10..2 55.88,25.72 R22..1 62.87,21.27 IC7..2
N$76
  Top 0.61: R23..1 72.07,3.81 72.07,14.61 IC7..1
  Bottom 0.61: C9..1 61.59,27.62 R22..2 IC7..1
N$77
  Top 0.61: IC7..7 64.14,9.84 48.9,9.84 | 48.9,9.84 48.9,20.64 R25..2 | R27..1 46.99,4.13 48.9,6.03 48.9,9.84
  Bottom 0.61: C11..1 65.41,7.94 IC7..7
N$78
  Bottom 0.61: R32..1 PR4..E
N$79
  Top 0.61: IC6.14 24.13,25.08 24.13,9.21 R32..2
N$80
  Top 0.61: IC6.15 25.4,26.99 27.3,28.89 28.57,28.89 31.11,26.35 R28..1
N$81
  Bottom 0.61: IC6.13 24.13,22.54 | 24.13,22.54 R31..1 | R27..2 20.95,4.13 24.13,7.3 24.13,22.54
N$82
  Top 0.61: R20..1 30.48,23.81 IC6.16
N$83
  Top 0.61: IC6.10 12.7,27.62 12.06,28.26 6.35,28.26 6.35,15.56 5.71,14.92 RV1..1S
N$84
  Bottom 0.61: IC6.9 8.26,24.45 | 8.26,24.45 8.26,23.18 9.53,21.91 11.43,21.91 R29..1 | 8.26,24.45 3.17,29.53 C12..2 C12..3
N$85
  Bottom 0.61: R30..1 8.89,20 6.35,22.54 6.35,24.45 4.45,26.35 C12..1
N$86
  Top 0.61: R25..1 51.44,19.37 51.44,17.46 53.98,14.92 59.05,14.92 IC7..6
  Bottom 0.61: C10..1 IC7..6
N$87
  Bottom 0.61: IC7..5 R26..3 R26..2 | 59.69,8.57 R26..2 | R26..2 57.78,6.67 55.24,4.13 RE7..2 RE7..3
N$88
  Top 0.61: CE1..1 138.43,16.19 R1..3 R1..2 RE1..2
N$89
  Top 0.61: RE2..2 RE2..3 138.11,18.41 135.89,16.19 | 135.89,16.19 130.18,16.19 IC1..3 | 135.89,16.19 138.11,13.97 CE2..3 CE2..2
N$90
  Top 0.61: R21..1 86.36,2.22 CE3..2 CE3..3
N$91
  Top 0.61: 62.87,22.86 57.47,22.86 CE4..2 CE4..3 | 62.87,22.86 IC7..3 | 62.87,22.86 64.45,24.45 RE6..2 RE5..3 RE5..2
N$92
  Top 0.61: IC6.12 17.78,26.99 15.24,29.53 2.54,29.53 1.27,28.26 1.27,10.48 1.91,9.84 3.73,9.84 RV1..1E
OUT1
  Top 0.61: PAD1.1 15.24,56.83 15.24,40.32 J1.3 15.88,37.78 19.05,34.61 19.05,25.72 15.24,21.91 15.24,9.84 J2.3 PAD2.1
OUT2  (via drill 0.6)
  Top 0.61: PAD17.1 13.97,56.52 13.97,53.34 13.02,52.39 10.48,52.39 8.26,50.16 8.26,45.4 | 8.26,45.4 8.26,42.86 10.79,40.32 J1.1 | 8.26,9.21 8.26,5.4 10.79,2.86 PAD18.1 | J2.1 8.26,9.21 | 8.26,9.21 v8.26,26.99 | v6.99,45.4 8.26,45.4
  Bottom 0.61: v8.26,26.99 6.99,28.26 v6.99,45.4
OUTPUT_AMP
  Bottom 0.61: R30.2 13.34,40.32 J1.2
OUTPUT_AMP_2
  Bottom 0.61: R30..2 13.34,9.84 J2.2
SLEW_RATE_CTRL
  Top 0.61: PAD12.1 D3.C 96.52,51.12 95.25,49.85 95.25,24.45 | 95.25,24.45 95.25,4.13 PAD11.1 | D3..C 95.25,24.45
SPEECH_IN
  Top 0.61: CE1.2 143.19,32.7 146.05,29.84 146.05,21.27 143.19,18.41 CE1..2 | CE1.2 143.19,47.94 146.69,51.12 PAD5.1 | PAD6.1 147.64,3.81 147.64,8.89 143.19,13.34 CE1..2 | CE1.2 CE1.3 | CE1..3 CE1..2
VU_DETECTOR
  Top 0.61: PAD7.1 98.42,56.2 98.42,39.05 | R14.2 98.42,39.05 | 98.42,39.05 JP1.1
VU_DETECTOR_2
  Top 0.61: JP1.2 98.42,10.48 R14..2 97.16,7.94 PAD8.1

### Text on the board
tNames: N/C ch 13 | 4V&B | 2 | 1 | Out | N/C between ch 9 & 10 | V/UV bus | 2 | 1 | Out | ETI Vocoder | Dual voice board v1.0 | N/C ch 12
bNames: Out 2 | Out 1 | Excit / input | Slew | V/UV | Speech | +12v | -12v | Channel: | 2 | 1 | 1 / 3 / 5 / 7 / 9 / 11 / 13 | -12v | Output buses: | Gnd | 1: Ch 1,2,4,6,8,10,12,14 | 2: Ch 3,5,7,9,11,13 | +12v | Channel: | 2 | 1 | 2 / 4 / 6 / 8 / 10 / 12 / 14